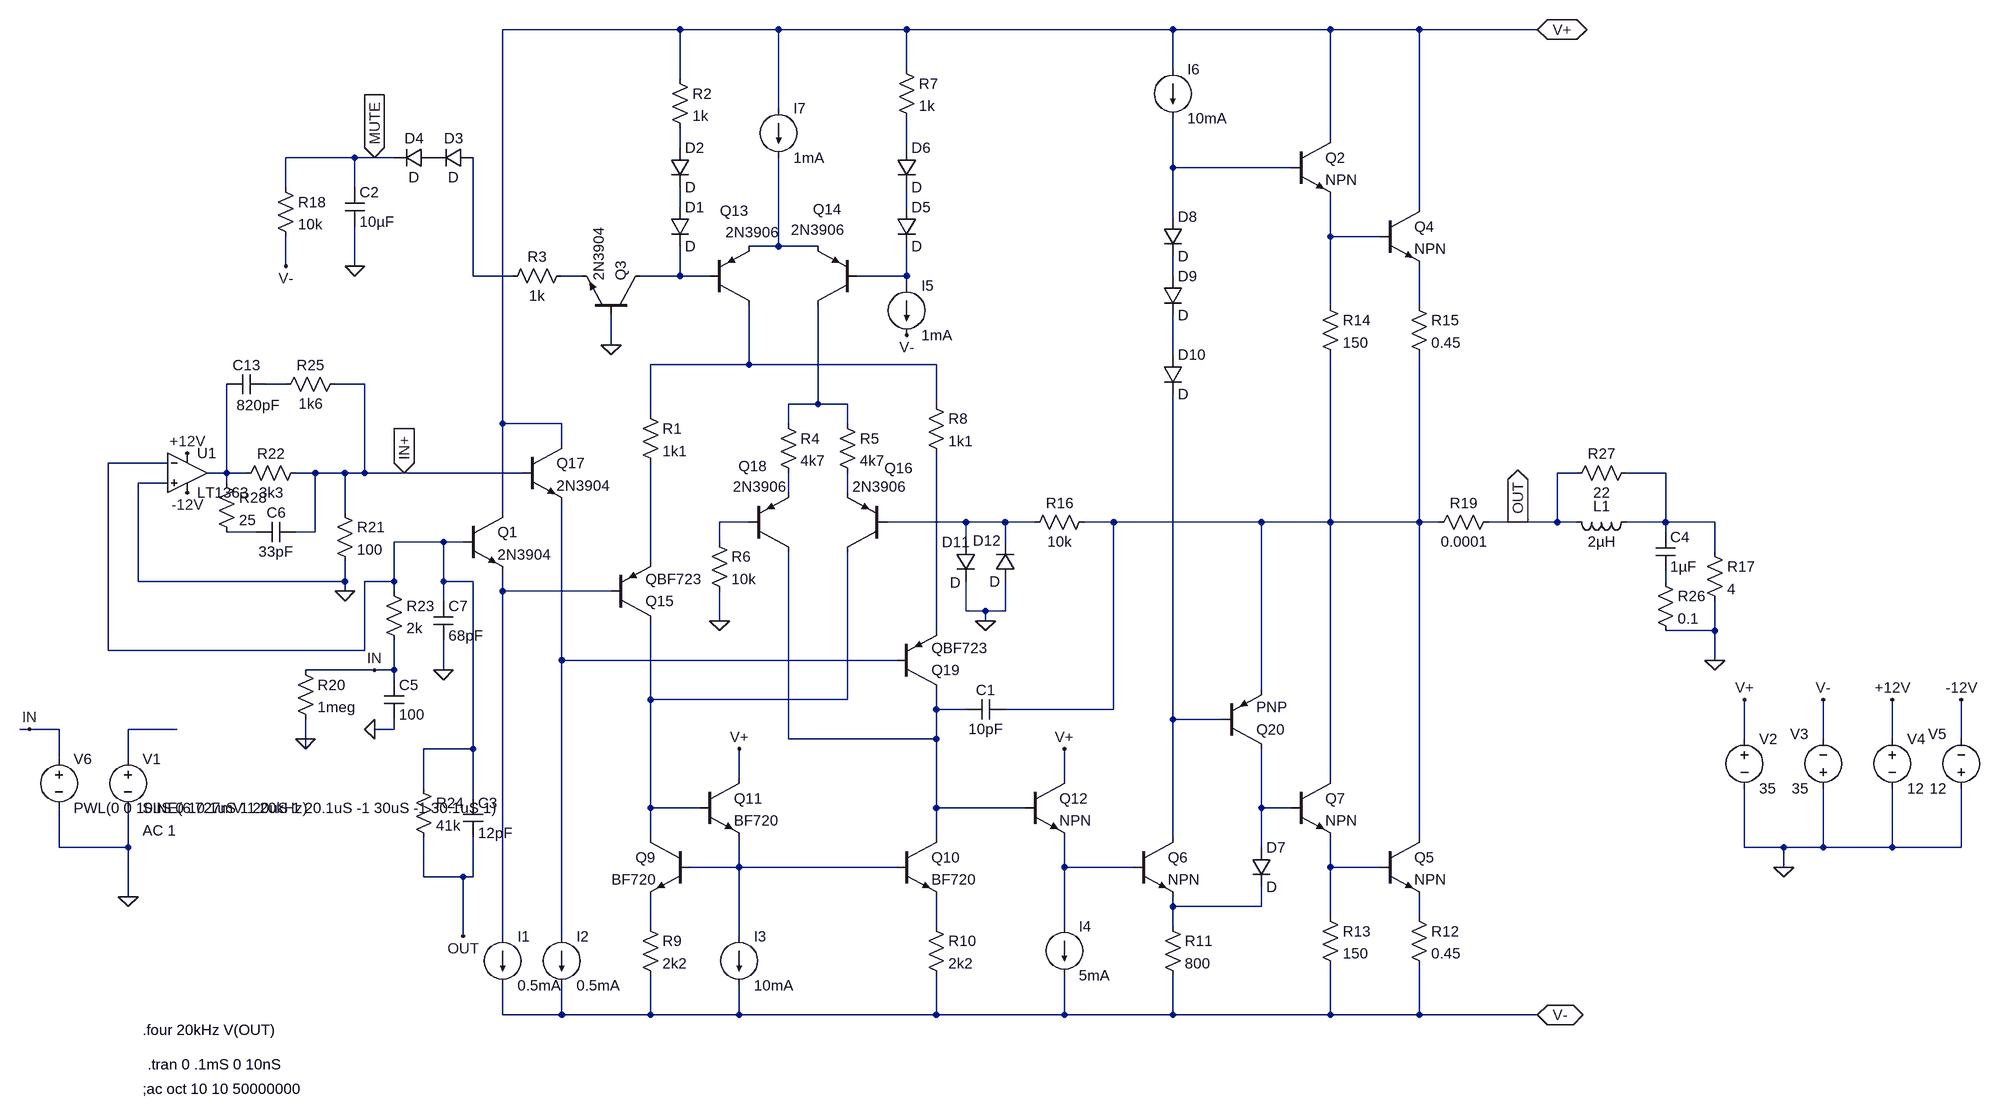
[diagram p0: schematic LM3886_MV2LT1363TRANSasc.asc]
LM3886_MV2LT1363TRANSasc.asc, the LTspice schematic file:
Version 4
SHEET 1 2284 1080
WIRE 144 -656 -144 -656
WIRE 304 -656 144 -656
WIRE 512 -656 304 -656
WIRE 944 -656 512 -656
WIRE 1200 -656 944 -656
WIRE 1344 -656 1200 -656
WIRE 1536 -656 1344 -656
WIRE 512 -592 512 -656
WIRE 944 -592 944 -656
WIRE 144 -576 144 -656
WIRE 304 -528 304 -656
WIRE 1200 -480 1200 -656
WIRE 144 -464 144 -496
WIRE 512 -464 512 -512
WIRE -384 -448 -496 -448
WIRE -352 -448 -384 -448
WIRE -320 -448 -352 -448
WIRE 944 -432 944 -512
WIRE 1136 -432 944 -432
WIRE -496 -400 -496 -448
WIRE -384 -400 -384 -448
WIRE 144 -368 144 -400
WIRE 512 -368 512 -400
WIRE 1344 -368 1344 -656
WIRE 944 -352 944 -432
WIRE 1200 -320 1200 -384
WIRE 1280 -320 1200 -320
WIRE 304 -304 304 -448
WIRE 304 -304 256 -304
WIRE 368 -304 304 -304
WIRE -496 -272 -496 -320
WIRE -384 -272 -384 -336
WIRE -192 -256 -192 -448
WIRE -128 -256 -192 -256
WIRE -16 -256 -48 -256
WIRE 144 -256 144 -304
WIRE 144 -256 80 -256
WIRE 192 -256 144 -256
WIRE 512 -256 512 -304
WIRE 512 -256 432 -256
WIRE 944 -256 944 -288
WIRE 512 -240 512 -256
WIRE 1200 -208 1200 -320
WIRE 1344 -208 1344 -272
WIRE 32 -144 32 -192
WIRE 944 -128 944 -192
WIRE 256 -112 256 -208
WIRE 256 -112 96 -112
WIRE 560 -112 256 -112
WIRE -496 -80 -528 -80
WIRE -368 -80 -416 -80
WIRE 368 -48 368 -208
WIRE 368 -48 320 -48
WIRE 416 -48 368 -48
WIRE 560 -48 560 -112
WIRE 96 -32 96 -112
WIRE -144 -16 -144 -656
WIRE -48 -16 -144 -16
WIRE 320 -16 320 -48
WIRE 416 -16 416 -48
WIRE -48 16 -48 -16
WIRE -688 48 -784 48
WIRE -592 64 -592 -80
WIRE -592 64 -624 64
WIRE -560 64 -592 64
WIRE -448 64 -480 64
WIRE -400 64 -448 64
WIRE -368 64 -368 -80
WIRE -368 64 -400 64
WIRE -304 64 -368 64
WIRE -112 64 -304 64
WIRE 1600 64 1568 64
WIRE 1744 64 1680 64
WIRE -688 80 -736 80
WIRE -592 80 -592 64
WIRE 320 96 320 64
WIRE 416 96 416 64
WIRE -400 128 -400 64
WIRE -144 128 -144 -16
WIRE 256 144 208 144
WIRE 608 144 480 144
WIRE 672 144 608 144
WIRE 720 144 672 144
WIRE 848 144 800 144
WIRE 1088 144 848 144
WIRE 1200 144 1200 -128
WIRE 1200 144 1088 144
WIRE 1344 144 1344 -128
WIRE 1344 144 1200 144
WIRE 1376 144 1344 144
WIRE 1504 144 1456 144
WIRE 1568 144 1568 64
WIRE 1568 144 1504 144
WIRE 1600 144 1568 144
WIRE 1744 144 1744 64
WIRE 1744 144 1680 144
WIRE 1824 144 1744 144
WIRE -544 160 -592 160
WIRE -448 160 -448 64
WIRE -448 160 -480 160
WIRE 1744 160 1744 144
WIRE -240 176 -320 176
WIRE -208 176 -240 176
WIRE 208 176 208 144
WIRE 608 176 608 144
WIRE 672 176 672 144
WIRE 1824 192 1824 144
WIRE 96 208 96 48
WIRE -736 240 -736 80
WIRE -400 240 -400 208
WIRE -400 240 -736 240
WIRE -320 240 -320 176
WIRE -320 240 -368 240
WIRE -240 240 -240 176
WIRE -192 240 -240 240
WIRE 1744 240 1744 224
WIRE -400 256 -400 240
WIRE -320 256 -320 240
WIRE -144 256 -144 224
WIRE 32 256 -144 256
WIRE -240 272 -240 240
WIRE 608 288 608 240
WIRE 640 288 608 288
WIRE 672 288 672 240
WIRE 672 288 640 288
WIRE 208 304 208 256
WIRE 640 304 640 288
WIRE 560 320 560 32
WIRE 1824 320 1824 272
WIRE 1824 320 1744 320
WIRE -784 352 -784 48
WIRE -368 352 -368 240
WIRE -368 352 -784 352
WIRE -48 368 -48 112
WIRE 496 368 -48 368
WIRE 1824 368 1824 320
WIRE -352 384 -464 384
WIRE -320 384 -320 336
WIRE -320 384 -352 384
WIRE -240 384 -240 336
WIRE -320 400 -320 384
WIRE 1088 416 1088 144
WIRE 96 432 96 304
WIRE 416 432 416 192
WIRE 416 432 96 432
WIRE 560 448 560 416
WIRE 608 448 560 448
WIRE 848 448 848 144
WIRE 848 448 672 448
WIRE 944 464 944 -64
WIRE 1024 464 944 464
WIRE -912 480 -928 480
WIRE -864 480 -912 480
WIRE -672 480 -752 480
WIRE -320 480 -320 464
WIRE -320 480 -352 480
WIRE -464 496 -464 464
WIRE 320 496 320 192
WIRE 560 496 560 448
WIRE 560 496 320 496
WIRE 1872 496 1872 432
WIRE 2000 496 2000 432
WIRE 2112 496 2112 432
WIRE 2224 496 2224 432
WIRE -464 512 -464 496
WIRE -192 512 -192 240
WIRE -192 512 -272 512
WIRE -864 528 -864 480
WIRE -752 528 -752 480
WIRE 240 560 240 512
WIRE 768 560 768 512
WIRE 1200 560 1200 144
WIRE -272 576 -272 512
WIRE -192 592 -192 512
WIRE 96 608 96 432
WIRE 176 608 96 608
WIRE 560 608 560 496
WIRE 704 608 560 608
WIRE 1088 608 1088 512
WIRE 1136 608 1088 608
WIRE 96 656 96 608
WIRE 560 656 560 608
WIRE 944 656 944 464
WIRE 1344 656 1344 144
WIRE -864 672 -864 608
WIRE -752 672 -752 608
WIRE -752 672 -864 672
WIRE 1088 672 1088 608
WIRE 1872 672 1872 576
WIRE 1936 672 1872 672
WIRE 2000 672 2000 576
WIRE 2000 672 1936 672
WIRE 2112 672 2112 576
WIRE 2112 672 2000 672
WIRE 2224 672 2224 576
WIRE 2224 672 2112 672
WIRE 240 704 240 656
WIRE 240 704 160 704
WIRE 496 704 240 704
WIRE 768 704 768 656
WIRE 880 704 768 704
WIRE 1200 704 1200 656
WIRE 1280 704 1200 704
WIRE 1936 704 1936 672
WIRE -272 720 -272 656
WIRE -208 720 -272 720
WIRE -192 720 -192 656
WIRE -192 720 -208 720
WIRE -752 752 -752 672
WIRE 944 768 944 752
WIRE 1088 768 1088 736
WIRE 1088 768 944 768
WIRE 1200 784 1200 704
WIRE 1344 784 1344 752
WIRE 96 800 96 752
WIRE 560 800 560 752
WIRE 768 800 768 704
WIRE 944 800 944 768
WIRE -208 816 -208 720
WIRE -144 816 -144 256
WIRE -48 816 -48 368
WIRE 240 816 240 704
WIRE -144 944 -144 896
WIRE -48 944 -48 896
WIRE -48 944 -144 944
WIRE 96 944 96 880
WIRE 96 944 -48 944
WIRE 240 944 240 896
WIRE 240 944 96 944
WIRE 560 944 560 880
WIRE 560 944 240 944
WIRE 768 944 768 880
WIRE 768 944 560 944
WIRE 944 944 944 880
WIRE 944 944 768 944
WIRE 1200 944 1200 864
WIRE 1200 944 944 944
WIRE 1344 944 1344 864
WIRE 1344 944 1200 944
WIRE 1536 944 1344 944
FLAG 208 304 0
FLAG 240 512 V+
FLAG 32 -144 0
FLAG 768 512 V+
FLAG 640 304 0
FLAG 512 -160 V-
FLAG -352 -448 MUTE
IOPIN -352 -448 In
FLAG -304 64 IN+
IOPIN -304 64 In
FLAG -352 480 0
FLAG 1504 144 OUT
IOPIN 1504 144 Out
FLAG 1536 -656 V+
IOPIN 1536 -656 BiDir
FLAG 1536 944 V-
IOPIN 1536 944 BiDir
FLAG 1824 368 0
FLAG -400 256 0
FLAG -384 -272 0
FLAG -496 -272 V-
FLAG -208 816 OUT
FLAG -752 752 0
FLAG 1872 432 V+
FLAG 2000 432 V-
FLAG 1936 704 0
FLAG -656 96 -12V
FLAG -656 32 +12V
FLAG 2224 432 -12V
FLAG 2112 432 +12V
FLAG -240 384 0
FLAG -912 480 IN
FLAG -464 496 0
FLAG -352 384 IN
SYMBOL npn -208 128 R0
SYMATTR InstName Q1
SYMATTR Value 2N3904
SYMBOL npn 1136 -480 R0
SYMATTR InstName Q2
SYMBOL npn 80 -192 M270
SYMATTR InstName Q3
SYMATTR Value 2N3904
SYMBOL npn 1280 -368 R0
SYMATTR InstName Q4
SYMBOL npn 1280 656 R0
SYMATTR InstName Q5
SYMBOL npn 880 656 R0
SYMATTR InstName Q6
SYMBOL npn 1136 560 R0
SYMATTR InstName Q7
SYMBOL npn 160 656 M0
SYMATTR InstName Q9
SYMATTR Value BF720
SYMBOL npn 496 656 R0
SYMATTR InstName Q10
SYMATTR Value BF720
SYMBOL npn 176 560 R0
SYMATTR InstName Q11
SYMATTR Value BF720
SYMBOL npn 704 560 R0
SYMATTR InstName Q12
SYMBOL pnp 192 -208 M180
WINDOW 0 17 154 Left 2
WINDOW 3 26 119 Left 2
SYMATTR InstName Q13
SYMATTR Value 2N3906
SYMBOL pnp 432 -208 R180
WINDOW 0 26 156 Left 2
WINDOW 3 23 123 Left 2
SYMATTR InstName Q14
SYMATTR Value 2N3906
SYMBOL pnp 32 304 M180
SYMATTR InstName Q15
SYMATTR Value QBF723
SYMBOL pnp 480 192 R180
WINDOW 0 -42 136 Left 2
WINDOW 3 -29 106 Left 2
SYMATTR InstName Q16
SYMATTR Value 2N3906
SYMBOL pnp 256 192 M180
WINDOW 0 -17 139 Left 2
WINDOW 3 -26 106 Left 2
SYMATTR InstName Q18
SYMATTR Value 2N3906
SYMBOL res 80 -48 R0
SYMATTR InstName R1
SYMATTR Value 1k1
SYMBOL diode 128 -368 R0
SYMATTR InstName D1
SYMBOL diode 128 -464 R0
SYMATTR InstName D2
SYMBOL res 128 -592 R0
SYMATTR InstName R2
SYMATTR Value 1k
SYMBOL res -32 -272 R90
WINDOW 0 0 56 VBottom 2
WINDOW 3 32 56 VTop 2
SYMATTR InstName R3
SYMATTR Value 1k
SYMBOL diode -192 -464 R90
WINDOW 0 0 32 VBottom 2
WINDOW 3 32 32 VTop 2
SYMATTR InstName D3
SYMBOL diode -256 -464 R90
WINDOW 0 0 32 VBottom 2
WINDOW 3 32 32 VTop 2
SYMATTR InstName D4
SYMBOL res 304 -32 R0
SYMATTR InstName R4
SYMATTR Value 4k7
SYMBOL res 400 -32 R0
SYMATTR InstName R5
SYMATTR Value 4k7
SYMBOL res 192 160 R0
SYMATTR InstName R6
SYMATTR Value 10k
SYMBOL diode 496 -368 R0
SYMATTR InstName D5
SYMBOL diode 496 -464 R0
SYMATTR InstName D6
SYMBOL res 496 -608 R0
SYMATTR InstName R7
SYMATTR Value 1k
SYMBOL pnp 496 416 M180
SYMATTR InstName Q19
SYMATTR Value QBF723
SYMBOL res 544 -64 R0
SYMATTR InstName R8
SYMATTR Value 1k1
SYMBOL res 80 784 R0
SYMATTR InstName R9
SYMATTR Value 2k2
SYMBOL res 544 784 R0
SYMATTR InstName R10
SYMATTR Value 2k2
SYMBOL res 928 784 R0
SYMATTR InstName R11
SYMATTR Value 800
SYMBOL diode 1072 672 R0
SYMATTR InstName D7
SYMBOL res 1328 768 R0
SYMATTR InstName R12
SYMATTR Value 0.45
SYMBOL res 1184 768 R0
SYMATTR InstName R13
SYMATTR Value 150
SYMBOL res 1184 -224 R0
SYMATTR InstName R14
SYMATTR Value 150
SYMBOL res 1328 -224 R0
SYMATTR InstName R15
SYMATTR Value 0.45
SYMBOL diode 928 -352 R0
SYMATTR InstName D8
SYMBOL diode 928 -256 R0
SYMATTR InstName D9
SYMBOL diode 928 -128 R0
SYMATTR InstName D10
SYMBOL pnp 1024 512 M180
SYMATTR InstName Q20
SYMBOL res 816 128 R90
WINDOW 0 0 56 VBottom 2
WINDOW 3 32 56 VTop 2
SYMATTR InstName R16
SYMATTR Value 10k
SYMBOL cap 672 432 R90
WINDOW 0 0 32 VBottom 2
WINDOW 3 32 32 VTop 2
SYMATTR InstName C1
SYMATTR Value 10pF
SYMBOL diode 592 176 R0
WINDOW 0 -23 0 Left 2
WINDOW 3 -10 66 Left 2
SYMATTR InstName D11
SYMBOL diode 688 240 R180
WINDOW 0 24 66 Left 2
WINDOW 3 24 0 Left 2
SYMATTR InstName D12
SYMBOL current -144 816 R0
WINDOW 123 0 0 Left 2
WINDOW 39 0 0 Left 2
SYMATTR InstName I1
SYMATTR Value 0.5mA
SYMBOL current -48 816 R0
WINDOW 123 0 0 Left 2
WINDOW 39 0 0 Left 2
SYMATTR InstName I2
SYMATTR Value 0.5mA
SYMBOL current 240 816 R0
WINDOW 123 0 0 Left 2
WINDOW 39 0 0 Left 2
SYMATTR InstName I3
SYMATTR Value 10mA
SYMBOL current 768 800 R0
WINDOW 123 0 0 Left 2
WINDOW 39 0 0 Left 2
SYMATTR InstName I4
SYMATTR Value 5mA
SYMBOL current 512 -240 R0
WINDOW 123 0 0 Left 2
WINDOW 39 0 0 Left 2
SYMATTR InstName I5
SYMATTR Value 1mA
SYMBOL npn -112 16 R0
SYMATTR InstName Q17
SYMATTR Value 2N3904
SYMBOL res 1808 176 R0
SYMATTR InstName R17
SYMATTR Value 4
SYMBOL res -512 -416 R0
SYMATTR InstName R18
SYMATTR Value 10k
SYMBOL cap -400 -400 R0
SYMATTR InstName C2
SYMATTR Value 10µF
SYMBOL voltage -752 512 R0
WINDOW 123 24 132 Left 2
WINDOW 39 0 0 Left 2
SYMATTR Value2 AC 1
SYMATTR InstName V1
SYMATTR Value SINE(6.727mV 1 20kHz)
SYMBOL voltage 1872 480 R0
WINDOW 123 0 0 Left 2
WINDOW 39 0 0 Left 2
SYMATTR InstName V2
SYMATTR Value 35
SYMBOL voltage 2000 592 R180
WINDOW 0 24 104 Left 2
WINDOW 3 24 16 Left 2
WINDOW 123 0 0 Left 2
WINDOW 39 0 0 Left 2
SYMATTR InstName V3
SYMATTR Value 35
SYMBOL current 944 -592 R0
WINDOW 123 0 0 Left 2
WINDOW 39 0 0 Left 2
SYMATTR InstName I6
SYMATTR Value 10mA
SYMBOL current 304 -528 R0
WINDOW 123 0 0 Left 2
WINDOW 39 0 0 Left 2
SYMATTR InstName I7
SYMATTR Value 1mA
SYMBOL res -416 112 R0
SYMATTR InstName R21
SYMATTR Value 100
SYMBOL res -464 48 R90
WINDOW 0 0 56 VBottom 2
WINDOW 3 32 56 VTop 2
SYMATTR InstName R22
SYMATTR Value 3k3
SYMBOL voltage 2112 480 R0
WINDOW 123 0 0 Left 2
WINDOW 39 0 0 Left 2
SYMATTR InstName V4
SYMATTR Value 12
SYMBOL voltage 2224 592 R180
WINDOW 0 24 104 Left 2
WINDOW 3 24 16 Left 2
WINDOW 123 0 0 Left 2
WINDOW 39 0 0 Left 2
SYMATTR InstName V5
SYMATTR Value 12
SYMBOL cap -528 -96 R90
WINDOW 0 0 32 VBottom 2
WINDOW 3 34 13 VTop 2
SYMATTR InstName C13
SYMATTR Value 820pF
SYMBOL res -336 240 R0
SYMATTR InstName R23
SYMATTR Value 2k
SYMBOL cap -256 272 R0
SYMATTR InstName C7
SYMATTR Value 68pF
SYMBOL res -288 560 R0
SYMATTR InstName R24
SYMATTR Value 41k
SYMBOL cap -208 592 R0
SYMATTR InstName C3
SYMATTR Value 12pF
SYMBOL Opamps\\LT1363 -656 0 R0
SYMATTR InstName U1
SYMBOL res -400 -96 R90
WINDOW 0 0 56 VBottom 2
WINDOW 3 32 56 VTop 2
SYMATTR InstName R25
SYMATTR Value 1k6
SYMBOL cap 1728 160 R0
SYMATTR InstName C4
SYMATTR Value 1µF
SYMBOL res 1472 128 R90
WINDOW 0 0 56 VBottom 2
WINDOW 3 32 56 VTop 2
SYMATTR InstName R19
SYMATTR Value 0.0001
SYMBOL cap -336 400 R0
SYMATTR InstName C5
SYMATTR Value 100
SYMBOL res -480 368 R0
SYMATTR InstName R20
SYMATTR Value 1meg
SYMBOL res 1728 224 R0
SYMATTR InstName R26
SYMATTR Value 0.1
SYMBOL ind 1696 128 R90
WINDOW 0 5 56 VBottom 2
WINDOW 3 32 56 VTop 2
SYMATTR InstName L1
SYMATTR Value 2µH
SYMBOL res 1696 48 R90
WINDOW 0 0 56 VBottom 2
WINDOW 3 32 56 VTop 2
SYMATTR InstName R27
SYMATTR Value 22
SYMBOL cap -480 144 R90
WINDOW 0 0 32 VBottom 2
WINDOW 3 32 32 VTop 2
SYMATTR InstName C6
SYMATTR Value 33pF
SYMBOL res -608 64 R0
SYMATTR InstName R28
SYMATTR Value 25
SYMBOL voltage -864 512 R0
WINDOW 123 0 0 Left 2
WINDOW 39 0 0 Left 2
SYMATTR InstName V6
SYMATTR Value PWL(0 0 10uS 0 10.1uS 1 20uS 1 20.1uS -1 30uS -1 30.1uS 1)
TEXT -720 1024 Left 2 !.tran 0 .1mS 0 10nS
TEXT -728 1064 Left 2 !;ac oct 10 10 50000000
TEXT -728 968 Left 2 !.four 20kHz V(OUT)

The netlist it stands for:
* LM3886_MV2LT1363TRANSasc.asc
Q1 V+ N018 N029 0 2N3904
Q2 V+ N003 N006 0 NPN
Q3 N010 0 N009 0 2N3904
Q4 V+ N006 N013 0 NPN
Q5 N025 N039 N041 0 NPN
Q6 N034 N038 N040 0 NPN
Q7 N025 N036 N039 0 NPN
Q9 N032 N037 N042 0 BF720
Q10 N033 N037 N043 0 BF720
Q11 V+ N032 N037 0 BF720
Q12 V+ N033 N038 0 NPN
Q13 N015 N010 N007 0 2N3906
Q14 N017 N011 N007 0 2N3906
Q15 N032 N029 N027 0 QBF723
Q16 N032 N024 N022 0 2N3906
Q18 N033 N023 N021 0 2N3906
R1 N015 N027 1k1
D1 N004 N010 D
D2 N001 N004 D
R2 V+ N001 1k
R3 N009 N008 1k
D3 N008 P001 D
D4 P001 MUTE D
R4 N017 N021 4k7
R5 N017 N022 4k7
R6 N023 0 10k
D5 N005 N011 D
D6 N002 N005 D
R7 V+ N002 1k
Q19 N033 N031 N030 0 QBF723
R8 N015 N030 1k1
R9 N042 V- 2k2
R10 N043 V- 2k2
R11 N040 V- 800
D7 N036 N040 D
R12 N041 V- 0.45
R13 N039 V- 150
R14 N006 N025 150
R15 N013 N025 0.45
D8 N003 N012 D
D9 N012 N014 D
D10 N014 N034 D
Q20 N036 N034 N025 0 PNP
R16 N025 N024 10k
C1 N025 N033 10pF
D11 N024 0 D
D12 0 N024 D
I1 N029 V- 0.5mA
I2 N031 V- 0.5mA
I3 N037 V- 10mA
I4 N038 V- 5mA
I5 N011 V- 1mA
Q17 V+ IN+ N031 0 2N3904
R17 N020 0 4
R18 MUTE V- 10k
C2 MUTE 0 10µF
V1 N035 0 SINE(6.727mV 1 20kHz) AC 1
V2 V+ 0 35
V3 0 V- 35
I6 V+ N003 10mA
I7 V+ N007 1mA
R21 IN+ 0 100
R22 IN+ N019 3k3
V4 +12V 0 12
V5 0 -12V 12
C13 N016 N019 820pF
R23 N018 IN 2k
C7 N018 0 68pF
R24 N018 OUT 41k
C3 N018 OUT 12pF
XU1 0 N018 +12V -12V N019 LT1363  ; pins In+ In- V+ V- OUT
R25 IN+ N016 1k6
C4 N020 N028 1µF
R19 OUT N025 0.0001
C5 IN 0 100
R20 IN 0 1meg
R26 N028 0 0.1
L1 N020 OUT 2µH
R27 N020 OUT 22
C6 IN+ N026 33pF
R28 N019 N026 25
V6 IN 0 PWL(0 0 10uS 0 10.1uS 1 20uS 1 20.1uS -1 30uS -1 30.1uS 1)
.model D D
.lib standard.dio
.model NPN NPN
.model PNP PNP
.lib standard.bjt
.tran 0 .1mS 0 10nS
;ac oct 10 10 50000000
.four 20kHz V(OUT)
.lib LT1363.sub
.backanno
.end